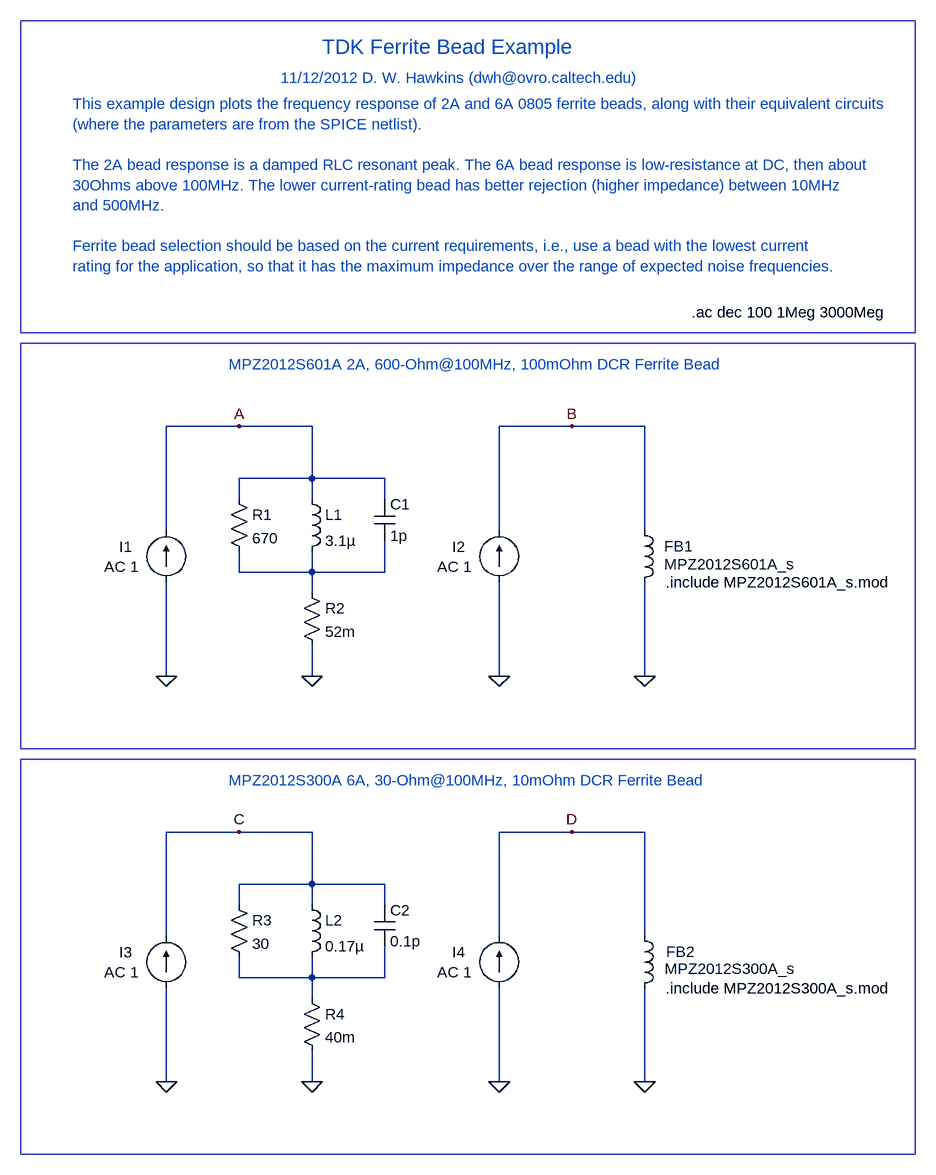
[diagram p0: schematic TDK_ferrite_bead.asc]
TDK_ferrite_bead.asc, the LTspice schematic file:
Version 4
SHEET 1 1912 1092
WIRE 304 -32 192 -32
WIRE 416 -32 304 -32
WIRE 816 -32 704 -32
WIRE 928 -32 816 -32
WIRE 416 48 416 -32
WIRE 416 48 304 48
WIRE 528 48 416 48
WIRE 304 80 304 48
WIRE 416 80 416 48
WIRE 528 80 528 48
WIRE 192 128 192 -32
WIRE 704 128 704 -32
WIRE 928 128 928 -32
WIRE 304 192 304 160
WIRE 416 192 416 160
WIRE 416 192 304 192
WIRE 528 192 528 144
WIRE 528 192 416 192
WIRE 416 224 416 192
WIRE 192 352 192 208
WIRE 416 352 416 304
WIRE 704 352 704 208
WIRE 928 352 928 208
WIRE 304 592 192 592
WIRE 416 592 304 592
WIRE 816 592 704 592
WIRE 928 592 816 592
WIRE 416 672 416 592
WIRE 416 672 304 672
WIRE 528 672 416 672
WIRE 304 704 304 672
WIRE 416 704 416 672
WIRE 528 704 528 672
WIRE 192 752 192 592
WIRE 704 752 704 592
WIRE 928 752 928 592
WIRE 304 816 304 784
WIRE 416 816 416 784
WIRE 416 816 304 816
WIRE 528 816 528 768
WIRE 528 816 416 816
WIRE 416 848 416 816
WIRE 192 976 192 832
WIRE 416 976 416 928
WIRE 704 976 704 832
WIRE 928 976 928 832
FLAG 192 352 0
FLAG 416 352 0
FLAG 304 -32 A
FLAG 704 352 0
FLAG 928 352 0
FLAG 816 -32 B
FLAG 704 976 0
FLAG 928 976 0
FLAG 816 592 D
FLAG 192 976 0
FLAG 416 976 0
FLAG 304 592 C
SYMBOL current 192 208 R180
WINDOW 0 52 55 Left 2
WINDOW 3 24 0 Left 2
WINDOW 123 42 24 Left 2
WINDOW 39 0 0 Left 2
SYMATTR InstName I1
SYMATTR Value ""
SYMATTR Value2 AC 1
SYMBOL res 288 64 R0
SYMATTR InstName R1
SYMATTR Value 670
SYMBOL res 400 208 R0
SYMATTR InstName R2
SYMATTR Value 52m
SYMBOL ind 400 64 R0
SYMATTR InstName L1
SYMATTR Value 3.1µ
SYMBOL cap 512 80 R0
SYMATTR InstName C1
SYMATTR Value 1p
SYMBOL current 704 208 R180
WINDOW 0 52 55 Left 2
WINDOW 3 24 0 Left 2
WINDOW 123 42 24 Left 2
WINDOW 39 0 0 Left 2
SYMATTR InstName I2
SYMATTR Value ""
SYMATTR Value2 AC 1
SYMBOL ind 912 112 R0
WINDOW 0 46 40 Left 2
WINDOW 3 46 68 Left 2
SYMATTR InstName FB1
SYMATTR Value MPZ2012S601A_s
SYMATTR Prefix X
SYMBOL current 704 832 R180
WINDOW 0 52 55 Left 2
WINDOW 3 24 0 Left 2
WINDOW 123 42 24 Left 2
WINDOW 39 0 0 Left 2
SYMATTR InstName I4
SYMATTR Value ""
SYMATTR Value2 AC 1
SYMBOL ind 912 736 R0
WINDOW 0 49 40 Left 2
WINDOW 3 47 66 Left 2
SYMATTR InstName FB2
SYMATTR Value MPZ2012S300A_s
SYMATTR Prefix X
SYMBOL current 192 832 R180
WINDOW 0 52 55 Left 2
WINDOW 3 24 0 Left 2
WINDOW 123 42 24 Left 2
WINDOW 39 0 0 Left 2
SYMATTR InstName I3
SYMATTR Value ""
SYMATTR Value2 AC 1
SYMBOL res 288 688 R0
SYMATTR InstName R3
SYMATTR Value 30
SYMBOL res 400 832 R0
SYMATTR InstName R4
SYMATTR Value 40m
SYMBOL ind 400 688 R0
SYMATTR InstName L2
SYMATTR Value 0.17µ
SYMBOL cap 512 704 R0
SYMATTR InstName C2
SYMATTR Value 0.1p
TEXT 1000 -208 Left 2 !.ac dec 100 1Meg 3000Meg
TEXT 960 208 Left 2 !.include MPZ2012S601A_s.mod
TEXT 960 832 Left 2 !.include MPZ2012S300A_s.mod
TEXT 288 -128 Left 2 ;MPZ2012S601A 2A, 600-Ohm@100MHz, 100mOhm DCR Ferrite Bead
TEXT 288 512 Left 2 ;MPZ2012S300A 6A, 30-Ohm@100MHz, 10mOhm DCR Ferrite Bead
TEXT 432 -616 Left 3 ;TDK Ferrite Bead Example
TEXT 368 -568 Left 2 ;11/12/2012 D. W. Hawkins (dwh@ovro.caltech.edu)
TEXT 48 -528 Left 2 ;This example design plots the frequency response of 2A and 6A 0805 ferrite beads, along with their equivalent circuits\n(where the parameters are from the SPICE netlist).\n \nThe 2A bead response is a damped RLC resonant peak. The 6A bead response is low-resistance at DC, then about\n30Ohms above 100MHz. The lower current-rating bead has better rejection (higher impedance) between 10MHz\nand 500MHz.\n \nFerrite bead selection should be based on the current requirements, i.e., use a bead with the lowest current\nrating for the application, so that it has the maximum impedance over the range of expected noise frequencies.
RECTANGLE Normal 1344 464 -32 -160
RECTANGLE Normal 1344 1088 -32 480
RECTANGLE Normal 1344 -176 -32 -656

The netlist it stands for:
* TDK_ferrite_bead.asc
I1 0 A AC 1
R1 A N001 670
R2 N001 0 52m
L1 A N001 3.1µ
C1 A N001 1p
I2 0 B AC 1
XFB1 B 0 MPZ2012S601A_s  ; pins A B
I4 0 D AC 1
XFB2 D 0 MPZ2012S300A_s  ; pins A B
I3 0 C AC 1
R3 C N002 30
R4 N002 0 40m
L2 C N002 0.17µ
C2 C N002 0.1p
.ac dec 100 1Meg 3000Meg
.include MPZ2012S601A_s.mod
.include MPZ2012S300A_s.mod
* MPZ2012S601A 2A, 600-Ohm@100MHz, 100mOhm DCR Ferrite Bead
* MPZ2012S300A 6A, 30-Ohm@100MHz, 10mOhm DCR Ferrite Bead
* TDK Ferrite Bead Example
* 11/12/2012 D. W. Hawkins (dwh@ovro.caltech.edu)
* This example design plots the frequency response of 2A and 6A 0805 ferrite beads, along with their equivalent circuits
* (where the parameters are from the SPICE netlist).
* The 2A bead response is a damped RLC resonant peak. The 6A bead response is low-resistance at DC, then about
* 30Ohms above 100MHz. The lower current-rating bead has better rejection (higher impedance) between 10MHz
* and 500MHz.
* Ferrite bead selection should be based on the current requirements, i.e., use a bead with the lowest current
* rating for the application, so that it has the maximum impedance over the range of expected noise frequencies.
.backanno
.end